# EAGLE design treiber (EAGLE 7.5.0)
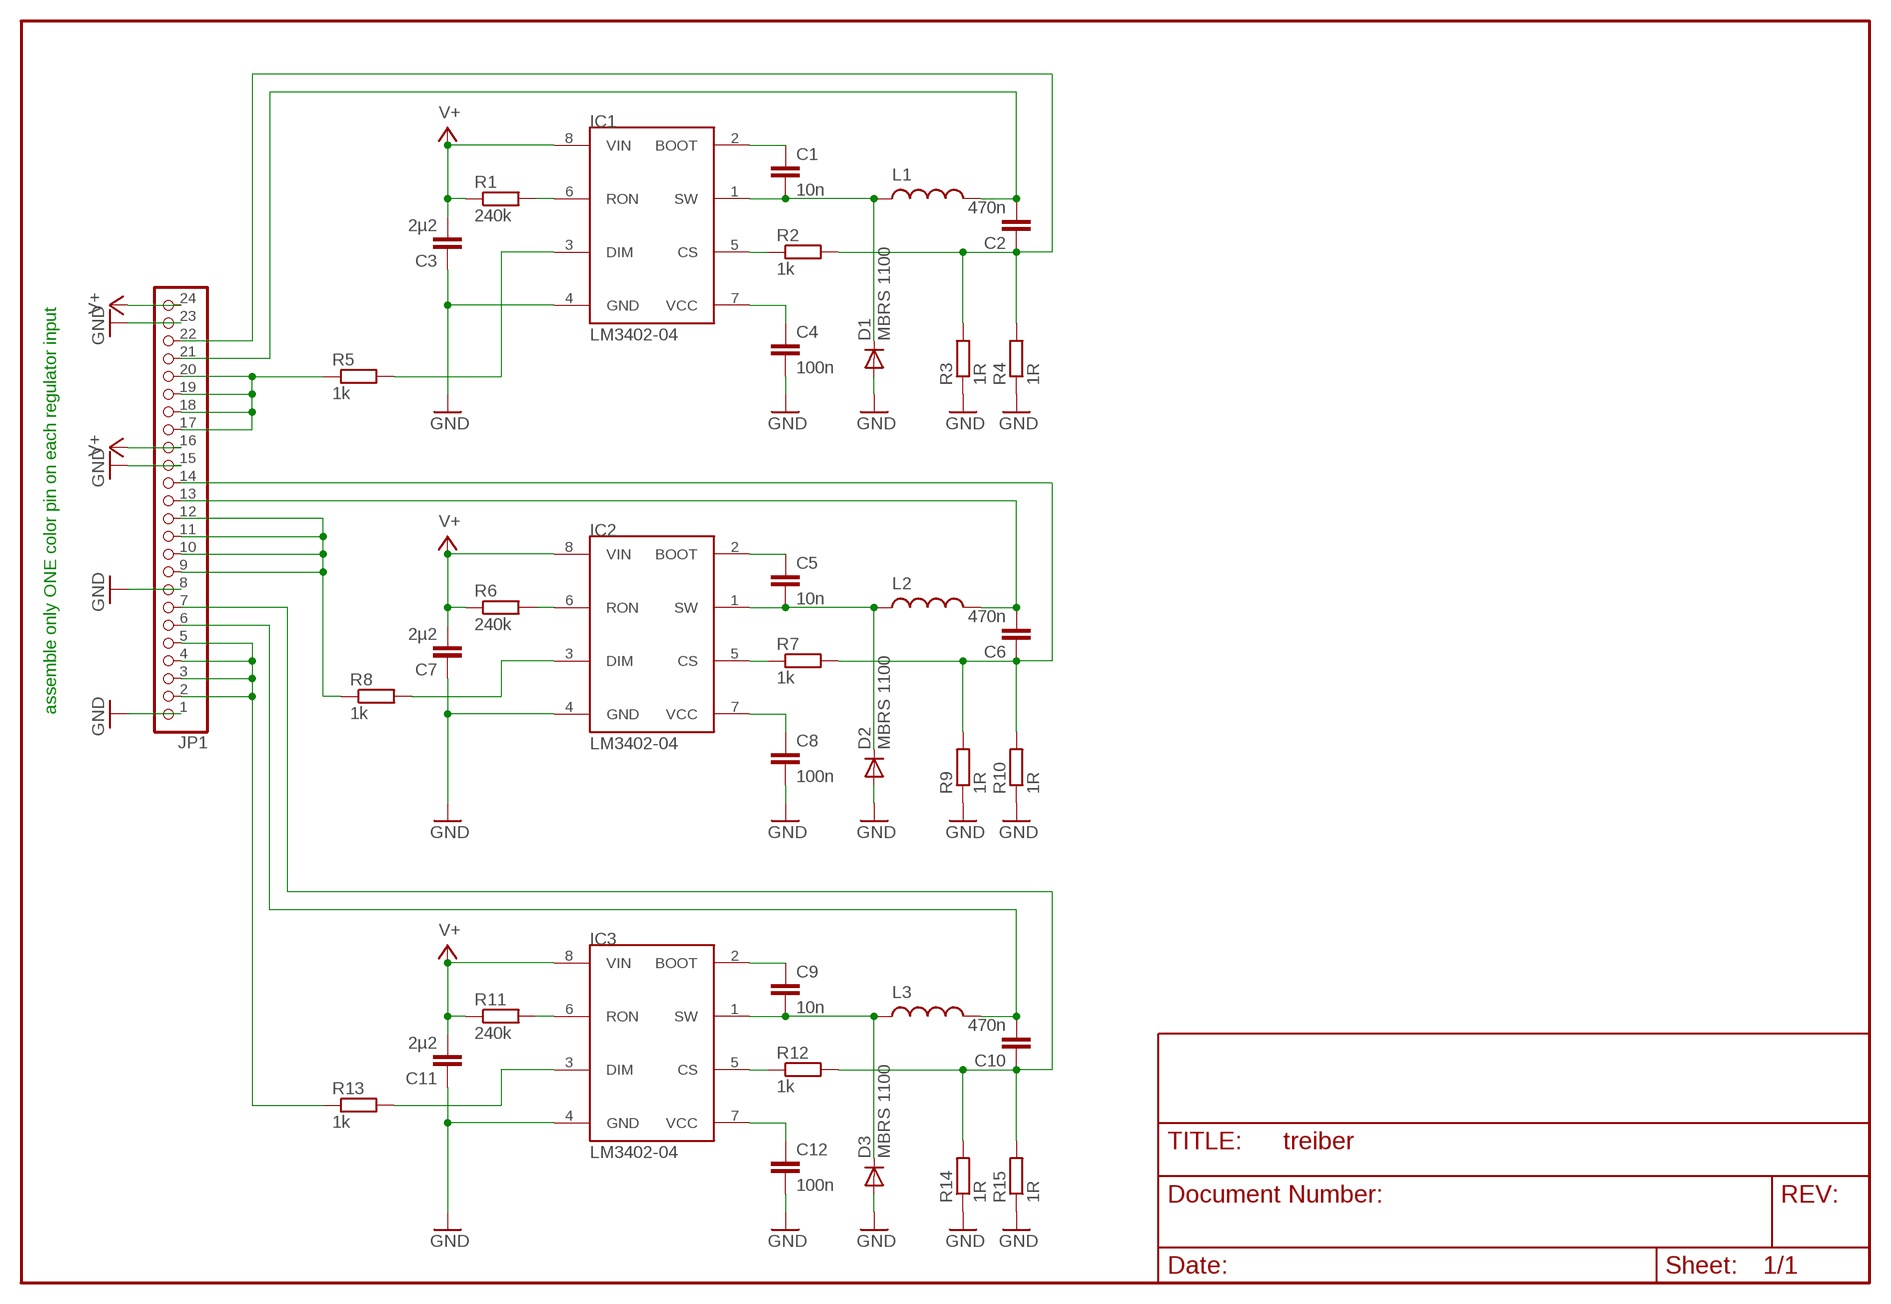
[diagram p0: schematic, sheet 1]

## Parts
C1  10n  C-EUC1206K  [C1206K]
C2  470n  C-EUC1206K  [C1206K]
C3  2µ2  C-EUC1206K  [C1206K]
C4  100n  C-EUC1206K  [C1206K]
C5  10n  C-EUC1206K  [C1206K]
C6  470n  C-EUC1206K  [C1206K]
C7  2µ2  C-EUC1206K  [C1206K]
C8  100n  C-EUC1206K  [C1206K]
C9  10n  C-EUC1206K  [C1206K]
C10  470n  C-EUC1206K  [C1206K]
C11  2µ2  C-EUC1206K  [C1206K]
C12  100n  C-EUC1206K  [C1206K]
D1  MBRS 1100  DIODE-  [DO214AA]
D2  MBRS 1100  DIODE-  [DO214AA]
D3  MBRS 1100  DIODE-  [DO214AA]
IC1  LM3402-04  [SOP08]
IC2  LM3402-04  [SOP08]
IC3  LM3402-04  [SOP08]
JP1  PINHD-1X24_2.54-SMD-90°  [1X24SMD/90]
L1  PIS4720  [PIS]
L2  PIS4720  [PIS]
L3  PIS4720  [PIS]
R1  240k  R-EU_R0805W  [R0805W]
R2  1k  R-EU_R1210W  [R1210W]
R3  1R  R-EU_R1210W  [R1210W]
R4  1R  R-EU_R1210W  [R1210W]
R5  1k  R-EU_R1210W  [R1210W]
R6  240k  R-EU_R0805W  [R0805W]
R7  1k  R-EU_R1210W  [R1210W]
R8  1k  R-EU_R1210W  [R1210W]
R9  1R  R-EU_R1210W  [R1210W]
R10  1R  R-EU_R1210W  [R1210W]
R11  240k  R-EU_R0805W  [R0805W]
R12  1k  R-EU_R1210W  [R1210W]
R13  1k  R-EU_R1210W  [R1210W]
R14  1R  R-EU_R1210W  [R1210W]
R15  1R  R-EU_R1210W  [R1210W]

## Nets
GND: C3.1 C4.2 C7.1 C8.2 C11.1 C12.2 D1.A D2.A D3.A IC1.4(GND) IC2.4(GND) IC3.4(GND) JP1.1 JP1.8 JP1.15 JP1.23 R3.1 R4.1 R9.1 R10.1 R14.1 R15.1
N$48: C4.1 IC1.7(VCC)
N$49: C1.1 IC1.2(BOOT)
N$50: C2.1 JP1.22 R2.2 R3.2 R4.2
N$51: IC1.6(RON) R1.2
N$53: JP1.17 JP1.18 JP1.19 JP1.20 R5.1
N$57: IC1.5(CS) R2.1
N$62: C1.2 D1.C IC1.1(SW) L1.P$2
N$63: C2.2 JP1.21 L1.P$1
N$64: IC1.3(DIM) R5.2
N$65: C8.1 IC2.7(VCC)
N$66: C5.1 IC2.2(BOOT)
N$67: IC2.6(RON) R6.2
N$68: JP1.9 JP1.10 JP1.11 JP1.12 R8.1
N$69: IC2.5(CS) R7.1
N$70: C5.2 D2.C IC2.1(SW) L2.P$2
N$71: C6.1 JP1.14 R7.2 R9.2 R10.2
N$72: C6.2 JP1.13 L2.P$1
N$73: IC2.3(DIM) R8.2
N$74: C12.1 IC3.7(VCC)
N$75: C9.1 IC3.2(BOOT)
N$76: IC3.6(RON) R11.2
N$77: JP1.2 JP1.3 JP1.4 JP1.5 R13.1
N$78: IC3.5(CS) R12.1
N$79: C9.2 D3.C IC3.1(SW) L3.P$2
N$80: C10.1 JP1.7 R12.2 R14.2 R15.2
N$81: C10.2 JP1.6 L3.P$1
N$82: IC3.3(DIM) R13.2
V+: C3.2 C7.2 C11.2 IC1.8(VIN) IC2.8(VIN) IC3.8(VIN) JP1.16 JP1.24 R1.1 R6.1 R11.1

## Notes on the sheet
- assemble only ONE color pin on each regulator input

## Library data of the parts
C1-C12 = rcl:C-EU: CAPACITOR, European symbol
D1-D3 = diode:DIODE-: DIODE
IC1-IC3 = Martin:LM3402-04: LM3402/02HV/3404/3404HV LED Current source
JP1 = pinhead-1:PINHD-1X24: PIN HEADER
L1-L3 = Martin:PIS4720: Fastron PIS4720 / PIS4728 Inductor
R1-R15 = rcl:R-EU_: RESISTOR, European symbol

## Board
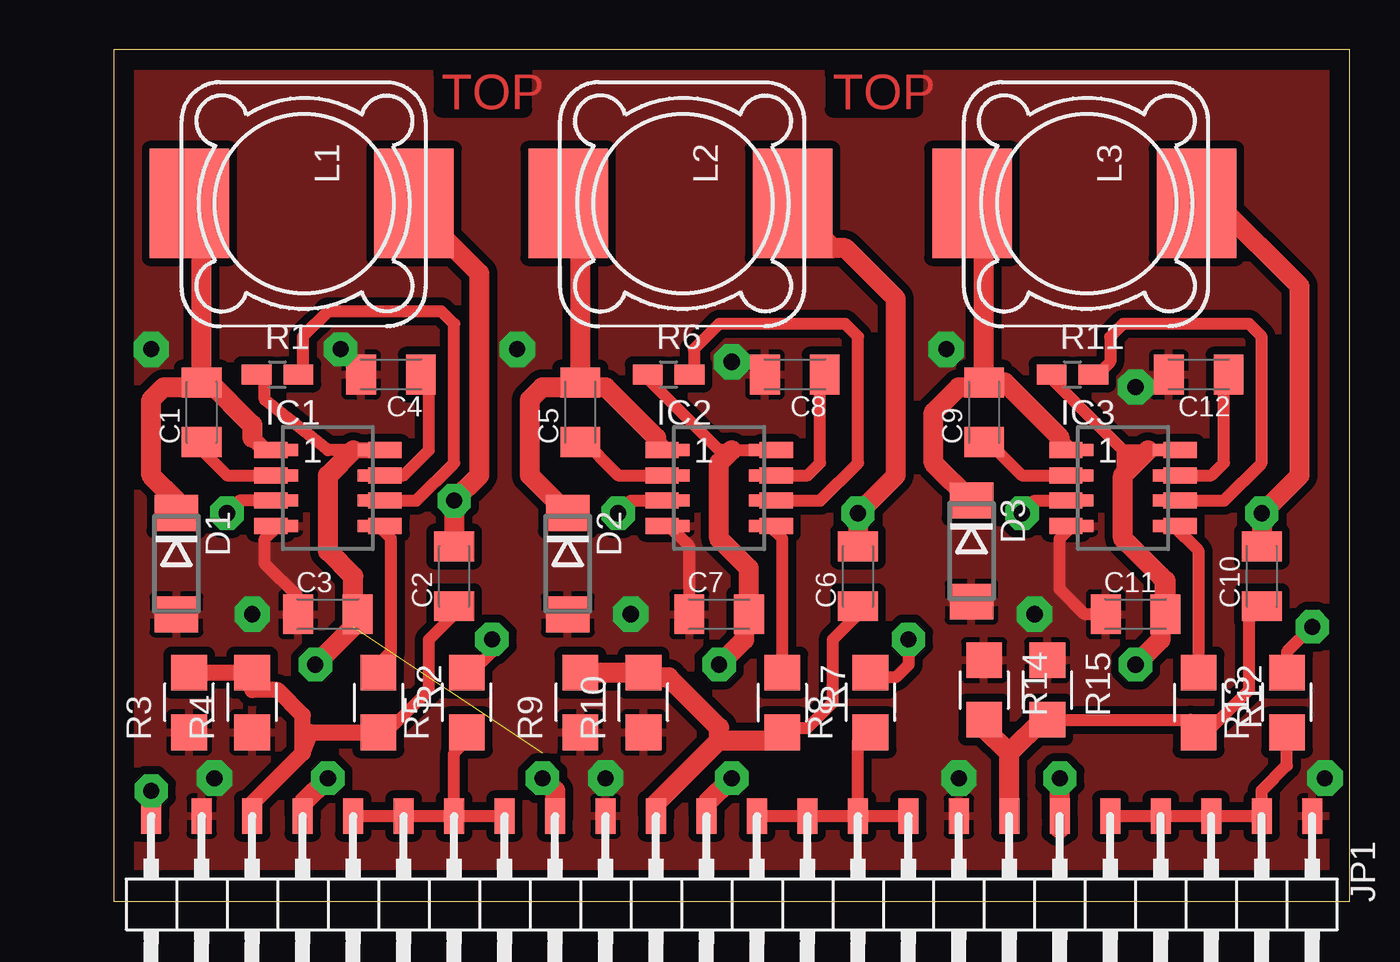
[diagram p1: board, top side]
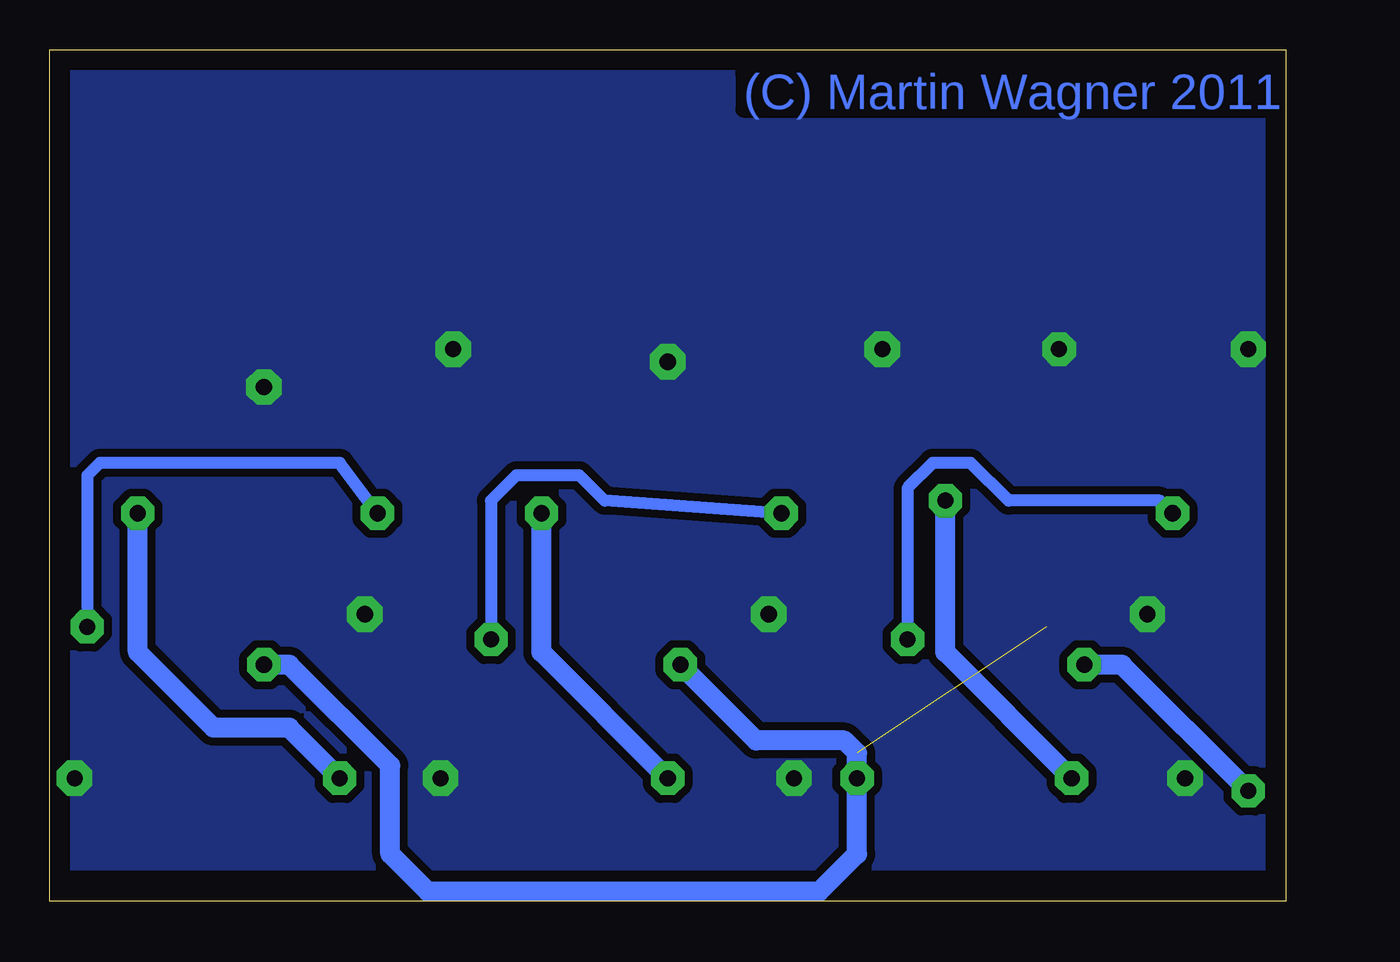
[diagram p2: board, bottom side, seen from below]

Size 62.21 x 42.85 mm. Coordinates in mm from the lower left corner, seen from the top.
Outline: 0,0 62.21,0 62.21,42.85 0,42.85 0,0
Copper layers (1*16): Top 0.035mm / dielectric 1.5mm / Bottom 0.035mm
Design rules "smd": minimum track width 10mil, minimum drill 5mil, track to track 0.4mm, track to pad 0.4mm, pad to pad 0.3mm, via to via 0.3mm, smd to smd 8mil, copper to edge 40mil, drill to drill 8mil, minimum pad ring 10mil, minimum via ring 8mil, stop-mask expansion 4mil, vias tented up to drill 0mil, thermal gap 10mil

### Footprints (pad centres in the part's own frame; a part is rotated, then mirrored left to right if it is on the bottom)
C1206K = smd 1.5 x 2: 1 -1.5,0; 2 1.5,0
DO214AA = smd 1.8 x 2.2: A 2.55,0; C -2.55,0
SOP08 = smd 0.6 x 2.2: 1 -1.905,-2.6; 2 -0.635,-2.6; 3 0.635,-2.6; 4 1.905,-2.6; 5 1.905,2.6; 6 0.635,2.6; 7 -0.635,2.6; 8 -1.905,2.6 | smd 0.813 x 1.676: P$1 -1.905,2.87; P$2 -0.635,2.87; P$3 0.635,2.87; P$4 1.905,2.87; P$5 1.905,-2.87; P$6 0.635,-2.87; P$7 -0.635,-2.87; P$8 -1.905,-2.87
1X24SMD/90 = smd 1.016 x 1.778: 1 -1.27,-5.08; 2 1.27,-5.08; 3 3.81,-5.08; 4 6.35,-5.08; 5 8.89,-5.08; 6 11.43,-5.08; 7 13.97,-5.08; 8 16.51,-5.08; 9 19.05,-5.08; 10 21.59,-5.08; 11 24.13,-5.08; 12 26.67,-5.08; 13 29.21,-5.08; 14 31.75,-5.08; 15 34.29,-5.08; 16 36.83,-5.08; 17 39.37,-5.08; 18 41.91,-5.08; 19 44.45,-5.08; 20 46.99,-5.08; 21 49.53,-5.08; 22 52.07,-5.08; 23 54.61,-5.08; 24 57.15,-5.08
PIS = smd 5.5 x 4: P$1 6,-0.75; P$2 6,-12.044
R0805W = smd 1.5 x 1: 1 -1.052,0; 2 1.052,0
R1210W = smd 1.8 x 1.8: 1 -1.499,0; 2 1.499,0

### Placement (x,y rotation side)
C1  4.44,24.6 90 top
C2  17.14,16.34 90 top
C3  10.79,14.44 0 top
C4  13.97,26.5 180 top
C5  23.49,24.6 90 top
C6  37.46,16.34 90 top
C7  30.47,14.44 0 top
C8  34.29,26.5 180 top
C9  43.81,24.6 90 top
C10  57.78,16.34 90 top
C11  51.43,14.44 0 top
C12  54.61,26.5 180 top
D1  3.17,16.98 270 top
D2  22.86,16.98 270 top
D3  43.18,17.61 270 top
IC1  10.79,20.79 270 top
IC2  30.47,20.79 270 top
IC3  50.8,20.79 270 top
JP1  59.05,-0.8 180 top
L1  15.87,41.11 270 top
L2  34.92,41.11 270 top
L3  55.24,41.11 270 top
R1  8.25,26.5 0 top
R2  13.33,10 270 top
R3  3.8,10 90 top
R4  6.98,10 90 top
R5  17.77,10 90 top
R6  27.93,26.5 0 top
R7  33.65,10 270 top
R8  38.1,10 90 top
R9  23.49,10 90 top
R10  26.66,10 90 top
R11  48.26,26.5 0 top
R12  54.61,10 270 top
R13  59.05,10 90 top
R14  43.81,10.63 270 top
R15  46.98,10.63 270 top

### Tracks (layer width: path | path; a pad name or v marks a point on that pad's centre or on a via)
GND  (via drill 0.81 pad 1.68, 0.81 pad 1.78)
  Top 0.406: R3.1 3.17,8.09 | R4.1 6.98,8.09
  Top 0.61: C3.1 9.29,15.31 7.62,16.98 7.62,18.25 8.25,18.88 IC1.4 | IC2.4 27.93,18.88 28.97,17.84 C7.1 | C11.1 48.89,14.44 47.62,15.71 47.62,18.25 48.26,18.88 IC3.4
  other vias: 6.98,14.44 5.08,6.18 1.9,27.77 20.31,27.77 11.43,27.77 31.11,27.14 41.91,27.77 26.03,14.44 24.76,6.18 42.54,6.18 46.35,14.44 51.43,25.87 60.96,6.18
  pour Top: 0.63,42.38 61.59,42.38 61.59,1.74 0.63,1.74
  pour Bottom: 0.63,42.38 61.59,42.38 61.59,1.74 0.63,1.74
N$48
  Top 0.61: IC1.7 14.6,21.42 15.87,22.7 15.87,25.87 15.24,26.5 C4.1
N$49
  Top 0.61: C1.1 4.44,22.7 5.71,21.42 IC1.2
N$50
  Top 0.61: R2.2 13.74,8.5 15.87,10.63 15.87,13.17 17.14,14.44 C2.1
  Top 0.813: JP1.22 6.98,4.92 9.52,7.46 | 9.52,7.46 9.52,9.36 8.25,10.63 6.98,10.63 R4.2 3.4,11.49 3.8,11.27 R3.2 | R2.2 9.93,8.5 9.52,7.46
N$51
  Top 0.61: 13.33,20.15 IC1.6 15.24,20.15 17.14,22.06 17.14,29.04 16.5,29.68 10.79,29.68 9.52,28.41 9.52,26.5 R1.2
N$53
  Top 0.61: JP1.20 JP1.19 JP1.18 | JP1.18 JP1.17 | R5.1 17.77,8.09 17.14,7.46 JP1.18
N$57
  Top 0.61: R2.1 13.33,11.9 13.97,12.54 13.97,18.25 13.33,18.88 IC1.5
N$62
  Top 0.813: IC1.1 7.62,22.7 6.98,23.33
  Top 1.016: 6.98,23.33 6.98,23.96 4.76,26.19 | 4.76,26.19 4.44,26.5 C1.2 4.44,34.12 3.8,34.76 3.83,34.78 L1.P$2 | D1.C 3.17,20.15 1.9,21.42 1.9,25.23 2.54,25.87 4.44,25.87 4.76,26.19
N$63  (via drill 0.81 pad 1.68)
  Top 1.016: L1.P$1 15.12,34.88 18.41,31.58 18.41,21.42 v17.14,20.15 C2.2 | v10.79,6.18 9.52,4.92 JP1.21
  Bottom 1.016: v17.14,20.15 17.14,12.54 v10.79,6.18
N$64  (via drill 0.81 pad 1.68)
  Top 0.61: IC1.3 6.34,20.15 v5.71,19.52 | R5.2 17.77,11.27 19.04,12.54 v19.04,13.17
  Bottom 0.61: v5.71,19.52 6.34,20.15 13.97,20.15 15.87,22.06 17.77,22.06 19.04,20.79 v19.04,13.17
N$65
  Top 0.61: IC2.7 34.92,21.42 35.55,22.06 35.55,25.87 36.19,26.5 C8.1
N$66
  Top 0.61: C5.1 23.49,23.33 25.39,21.42 IC2.2
N$67
  Top 0.61: IC2.6 35.55,20.15 37.46,22.06 37.46,28.41 36.83,29.04 30.47,29.04 29.2,27.77 29.2,26.5 R6.2
N$68
  Top 0.61: JP1.12 JP1.11 JP1.10 | JP1.10 JP1.9 | R8.1 38.1,8.73 37.46,8.09 JP1.10
N$69
  Top 0.61: IC2.5 33.02,18.88 33.65,18.25 R7.1
N$70
  Top 0.61: IC2.1 27.93,22.7 27.3,23.33
  Top 1.016: D2.C 22.84,19.53 20.95,21.42 20.95,25.23 21.58,25.87 23.49,25.87 | 23.49,25.87 C5.2 23.49,34.12 22.86,34.76 22.88,34.78 L2.P$2 | 23.49,25.87 24.76,25.87 27.3,23.33
N$71
  Top 0.61: C6.1 37.46,14.44 36.19,13.17 36.19,10 34.92,8.73 33.65,8.73
  Top 1.016: JP1.14 27.3,4.92 30.47,8.09 | R7.2 33.65,8.73 33.02,8.09 30.47,8.09 | 30.47,8.09 30.47,8.73 27.93,11.27 26.66,11.27 R10.2 23.72,11.49 23.49,11.27 R9.2
N$72  (via drill 0.81 pad 1.68)
  Top 1.016: L2.P$1 34.17,34.88 36.19,32.85 36.83,32.85 39.37,30.31 39.37,21.42 v37.46,19.52 C6.2 | v31.11,6.18 29.84,4.92 JP1.13
  Bottom 1.016: v37.46,19.52 37.46,12.54 v31.11,6.18
N$73  (via drill 0.81 pad 1.68)
  Top 0.61: v40,13.17 40,11.9 39.37,11.27 38.1,11.27 R8.2 | v25.39,19.52 26.03,20.15 IC2.3 27.93,20.15
  Bottom 0.61: v25.39,19.52 34.29,20.15 35.55,21.42 38.73,21.42 40,20.15 v40,13.17
N$74
  Top 0.61: IC3.7 55.24,21.42 55.88,22.06 55.88,25.87 56.51,26.5 C12.1
N$75
  Top 0.61: C9.1 43.81,23.33 45.72,21.42 IC3.2
N$76
  Top 0.61: IC3.6 55.88,20.15 57.78,22.06 57.78,28.41 57.15,29.04 50.8,29.04 50.16,28.41 50.16,27.14 49.53,26.5 R11.2
N$77
  Top 0.61: JP1.5 JP1.4 JP1.3 | JP1.3 JP1.2 | JP1.3 JP1.2 | JP1.2 57.78,5.55 59.05,6.82 R13.1 59.05,8.73
N$78
  Top 0.61: IC3.5 53.34,18.88 54.61,17.61 R12.1
N$79
  Top 0.61: IC3.1 48.26,22.7 47.62,23.33
  Top 1.016: D3.C 43.16,20.16 41.27,22.06 41.27,24.6 42.54,25.87 43.81,25.87 | 43.81,25.87 C9.2 44.85,26.1 47.62,23.33 | L3.P$2 43.2,34.78 43.18,34.76 43.81,34.12 43.81,25.87
N$80
  Top 0.61: R15.2 54.2,9.13 54.61,8.73 | R12.2 55.01,8.5 57.15,10.63 57.15,14.44 57.78,15.08 C10.1
  Top 1.016: R14.2 43.81,8.73 45.08,7.46 | JP1.7 45.08,7.46 | R15.2 46.76,9.13 45.08,7.46 | 54.61,8.73 R12.2
N$81  (via drill 0.81 pad 1.68)
  Top 1.016: L3.P$1 55.53,35.11 59.69,30.95 59.69,21.42 v57.78,19.52 C10.2 | v47.62,6.18 JP1.6 47.62,3.64
  Bottom 1.016: v47.62,6.18 50.16,8.73 53.97,8.73 57.78,12.54 v57.78,19.52
N$82  (via drill 0.81 pad 1.68)
  Top 0.61: R13.2 59.05,12.54 v60.32,13.81 | v45.72,19.52 46.35,20.15 IC3.3 48.26,20.15
  Bottom 0.61: v60.32,13.81 60.32,21.42 59.69,22.06 47.62,22.06 v45.72,19.52
V+  (via drill 0.81 pad 1.68)  (1 unrouted)
  Top 0.61: IC1.8 10.79,22.7 7.62,25.23 7.62,26.5 R1.1 | IC2.8 31.11,22.7 30.47,22.7 26.66,26.5 R6.1 | 52.07,22.7 IC3.8 50.8,22.7 | 50.8,22.7 46.98,26.5 R11.1 47.2,26.29 50.8,22.7 | 50.8,18.25 50.8,22.7 | 52.7,13.81 52.7,16.34
  Top 0.813: 12.06,22.7 IC1.8
  Top 1.016: 12.06,22.7 10.79,21.42 10.79,17.61 12.06,16.34 12.06,14.44 | 12.06,14.44 C3.2 | 12.06,14.44 12.06,13.81 v10.16,11.9 | JP1.24 v1.9,5.55 | 31.11,22.7 30.47,22.06 30.47,18.25 31.97,16.75 C7.2 31.74,14.44 31.74,13.17 v30.47,11.9 | JP1.16 22.22,5.55 v21.58,6.18 | C11.2 52.93,16.11 52.7,16.34 50.8,18.25 50.8,21.42 52.07,22.7 | 52.7,13.81 52.7,13.17 v51.43,11.9
  Bottom 1.016: v10.16,11.9 8.25,11.9 v1.9,5.55 | v30.47,11.9 26.66,8.09 22.22,8.09 21.58,7.46 v21.58,6.18 21.58,2.38 23.49,0.47 43.18,0.47 45.08,2.38 45.08,6.82 50.16,11.9 v51.43,11.9

### Text on the board
Top: TOP | TOP
Bottom: (C) Martin Wagner 2011